# EAGLE schematic tool_psu (EAGLE 9.1.3)
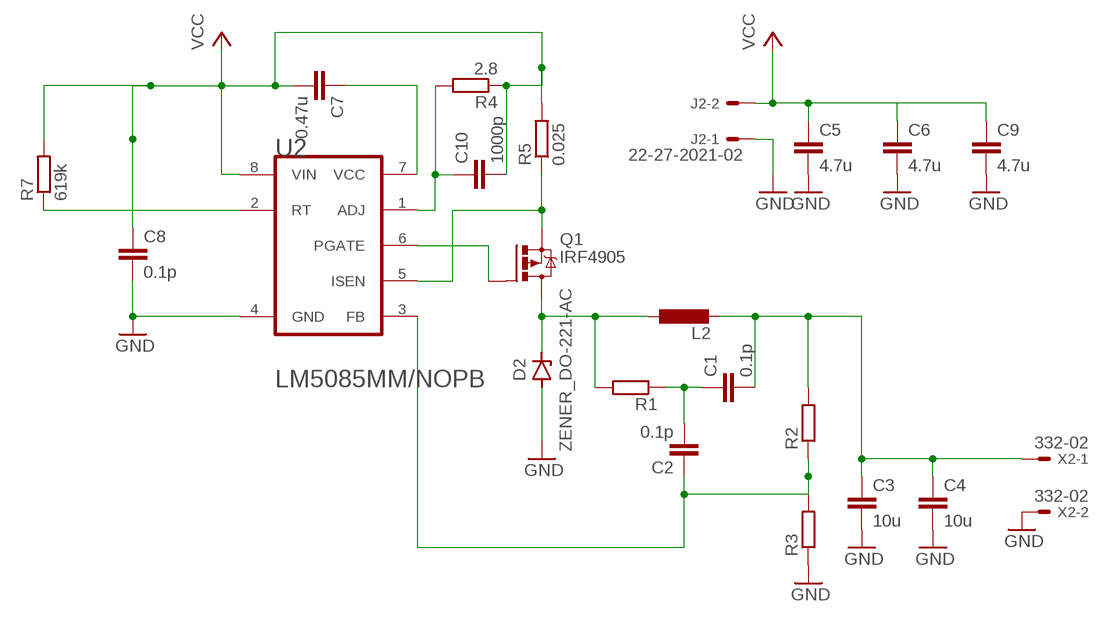
[diagram p0: schematic, sheet 1]

## Parts
C1  0.1p  C-EUC1206  [C1206]
C2  0.1p  C-EUC1206  [C1206]
C3  10u  C-EUC1206  [C1206]
C4  10u  C-EUC1206  [C1206]
C5  4.7u  C-EUC1206  [C1206]
C6  4.7u  C-EUC1206  [C1206]
C7  0.47u  C-EUC1206  [C1206]
C8  0.1p  C-EUC1206  [C1206]
C9  4.7u  C-EUC1206  [C1206]
C10  1000p  C-EUC1206  [C1206]
D2  ZENER_DO-221-AC  [SODFL5226X110]
J2  22-27-2021-02  [6410-02]
L2  L-EU0204/5  [0204/5]
Q1  IRF4905  [TO220BH]
R1  R-EU_M1206  [M1206]
R2  R-EU_M1206  [M1206]
R3  R-EU_M1206  [M1206]
R4  2.8  R-EU_M1206  [M1206]
R5  0.025  R-EU_M1206  [M1206]
R7  619k  R-EU_M1206  [M1206]
U2  TI_NATIONAL_SEMICONDUCTOR_LM5085MM-NOPBTI_NATIONAL_SEMICONDUCTOR_LM5085MM-NOPB_0_0  [TI_NATIONAL_SEMICONDUCTOR_LM5085MM-NOPB_0]
X2  332-02  [332-02]

## Nets
GND: C3.2 C4.2 C5.2 C6.2 C8.2 C9.2 D2.2(A) J2.1 R3.1 U2.4(GND) X2.2
N$1: C1.2 C3.1 C4.1 L2.2 R2.2 X2.1
N$2: D2.1(C) L2.1 Q1.D R1.2
N$3: R7.1 U2.2(RT)
N$4: C1.1 C2.2 R1.1
N$5: C2.1 R2.1 R3.2 U2.3(FB)
N$6: C6.1
N$7: C10.1 R4.2 U2.1(ADJ)
N$8: Q1.G U2.6(PGATE)
N$9: Q1.S R5.1 U2.5(ISEN)
N$13: C7.1 U2.7(VCC)
VCC: C5.1 C7.2 C8.1 C9.1 C10.2 J2.2 R4.1 R5.2 R7.2 U2.8(VIN)

## Library data of the parts
C1-C10 = rcl:C-EU: CAPACITOR, European symbol; SPICEPREFIX: C
D2 = Diode:ZENER: Zener Diode - Generic; CATEGORY: Diode; SUB-CATEGORY: Zener
J2 = con-molex:22-?-02: CONNECTOR wire to board 2.54 mm (.1 inch) pitch header; MF: MOLEX; OC_FARNELL: unknown; OC_NEWARK: unknown
L2 = rcl:L-EU: INDUCTOR, European symbol; SPICEPREFIX: L
Q1 = transistor-power:IRF4905: P-Channel HEXFET® Power MOSFET RDS(on)= 0.02 Ohm, ID = -74A Source: http://www.irf.com/product-info/datasheets/data/irf4905pbf.pdf
R1-R5 R7 = rcl:R-EU_: RESISTOR, European symbol; SPICEPREFIX: R
U2 = LM5085:TI_NATIONAL_SEMICONDUCTOR_LM5085MM-NOPB: PM-SWREG-LM5085-8; CIIVA_IDS: 1480259; CODE__JEDEC: MO-187-AA; COMPONENT_LINK_1_DESCRIPTION: Datasheet URL; COMPONENT_LINK_1_URL: http://www.ti.com/general/docs/lit/getliterature.tsp?genericPartNumber=LM5085&fileType=pdf; COMP_TYPE: Switcher; FOOTPRINT_VARIANT_NAME_0: Level C; FOOTPRINT_VARIANT_NAME_1: Level B; FOOTPRINT_VARIANT_NAME_2: Level A; IMPORTED: yes; IMPORTED_FROM: vault; IMPORT_TS: 1521843347; MF: TI National Semiconductor; MPN: LM5085MM/NOPB; PACKAGE: DGK0008A; PACKAGE_DESCRIPTION: MINI SOIC, .118 x .118 x .034in, 8 Lead, .0256in Pitch; PACKAGE_TOP_MARKING: ZXTT*SSTB; PIN_COUNT: 8; POWER_WISE: Y; PREFIX: U; RELEASE_DATE: 1464095424; ROHS: Yes; VAULT_GUID: D98874AE-3CDE-427A-8684-C942B0CAD19D; VAULT_REVISION: 630B4D72-397E-4948-96D0-B42EDD290CB1
X2 = con-garry:332-02: 2 Pin - 2mm Dual Row Source: www.mpe-connector.de / garry_shortform_2012.pdf